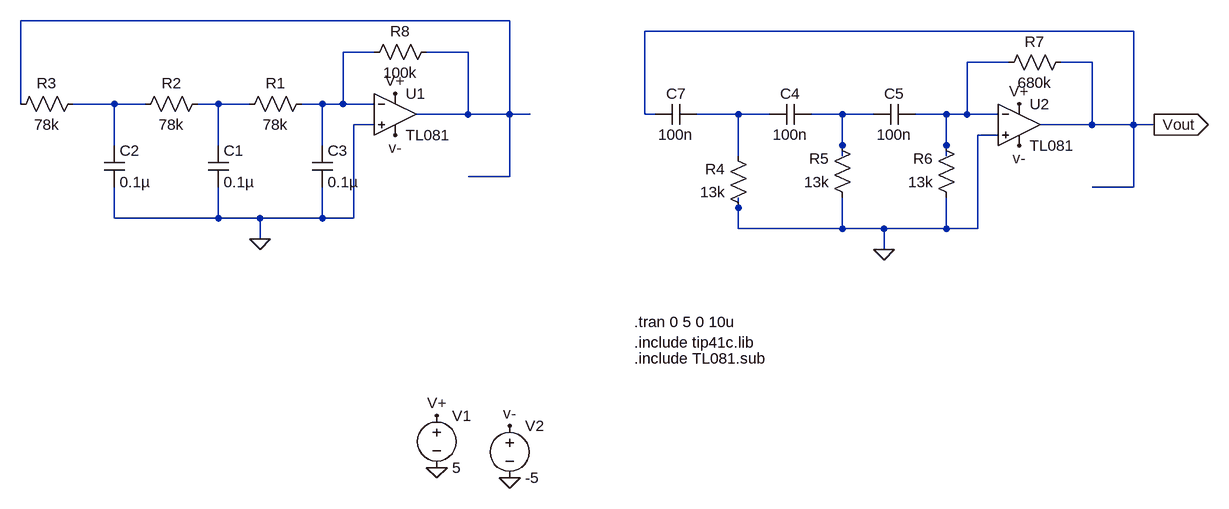
[diagram p0: schematic vib4_phase_shift.asc]
vib4_phase_shift.asc, the LTspice schematic file:
Version 4
SHEET 1 1456 680
WIRE 352 -96 -400 -96
WIRE 1312 -80 560 -80
WIRE 144 -48 96 -48
WIRE 288 -48 224 -48
WIRE 1120 -32 1056 -32
WIRE 1248 -32 1200 -32
WIRE -400 32 -400 -96
WIRE -256 32 -320 32
WIRE -208 32 -256 32
WIRE -96 32 -128 32
WIRE -48 32 -96 32
WIRE 64 32 32 32
WIRE 96 32 96 -48
WIRE 96 32 64 32
WIRE 144 32 96 32
WIRE 288 48 288 -48
WIRE 288 48 208 48
WIRE 352 48 352 -96
WIRE 352 48 288 48
WIRE 384 48 352 48
WIRE 560 48 560 -80
WIRE 576 48 560 48
WIRE 704 48 640 48
WIRE 752 48 704 48
WIRE 864 48 816 48
WIRE 912 48 864 48
WIRE 1024 48 976 48
WIRE 1056 48 1056 -32
WIRE 1056 48 1024 48
WIRE 1104 48 1056 48
WIRE 144 64 112 64
WIRE 1248 64 1248 -32
WIRE 1248 64 1168 64
WIRE 1312 64 1312 -80
WIRE 1312 64 1248 64
WIRE 1344 64 1312 64
WIRE 1104 80 1072 80
WIRE -256 96 -256 32
WIRE -96 96 -96 32
WIRE 64 96 64 32
WIRE 864 96 864 48
WIRE 1024 96 1024 48
WIRE 704 112 704 48
WIRE 864 112 864 96
WIRE 1024 112 1024 96
WIRE 352 144 352 48
WIRE 352 144 288 144
WIRE 1312 160 1312 64
WIRE 1312 160 1248 160
WIRE 704 192 704 176
WIRE -256 208 -256 160
WIRE -96 208 -96 160
WIRE -96 208 -256 208
WIRE -32 208 -96 208
WIRE 64 208 64 160
WIRE 64 208 -32 208
WIRE 112 208 112 64
WIRE 112 208 64 208
WIRE 704 224 704 192
WIRE 864 224 864 176
WIRE 864 224 704 224
WIRE 928 224 864 224
WIRE 1024 224 1024 176
WIRE 1024 224 928 224
WIRE 1072 224 1072 80
WIRE 1072 224 1024 224
WIRE -32 240 -32 208
WIRE 928 256 928 224
FLAG 176 16 V+
FLAG 240 592 0
FLAG 352 528 v-
FLAG 176 80 v-
FLAG 352 608 0
FLAG -32 240 0
FLAG 1344 64 Vout
IOPIN 1344 64 Out
FLAG 1136 32 V+
FLAG 1136 96 v-
FLAG 928 256 0
FLAG 240 512 V+
SYMBOL OpAmps\\opamp2 176 -16 R0
SYMATTR InstName U1
SYMATTR Value TL081
SYMBOL voltage 240 496 R0
WINDOW 123 0 0 Left 0
WINDOW 39 0 0 Left 0
SYMATTR InstName V1
SYMATTR Value 5
SYMBOL voltage 352 512 R0
WINDOW 123 0 0 Left 0
WINDOW 39 0 0 Left 0
SYMATTR InstName V2
SYMATTR Value -5
SYMBOL res 48 16 R90
WINDOW 0 0 56 VBottom 2
WINDOW 3 32 56 VTop 2
SYMATTR InstName R1
SYMATTR Value 78k
SYMBOL res -112 16 R90
WINDOW 0 0 56 VBottom 2
WINDOW 3 32 56 VTop 2
SYMATTR InstName R2
SYMATTR Value 78k
SYMBOL res -304 16 R90
WINDOW 0 0 56 VBottom 2
WINDOW 3 32 56 VTop 2
SYMATTR InstName R3
SYMATTR Value 78k
SYMBOL cap -112 96 R0
SYMATTR InstName C1
SYMATTR Value 0.1µ
SYMBOL cap -272 96 R0
SYMATTR InstName C2
SYMATTR Value 0.1µ
SYMBOL cap 48 96 R0
SYMATTR InstName C3
SYMATTR Value 0.1µ
SYMBOL OpAmps\\opamp2 1136 0 R0
SYMATTR InstName U2
SYMATTR Value TL081
SYMBOL cap 640 32 R90
WINDOW 0 0 32 VBottom 2
WINDOW 3 32 32 VTop 2
SYMATTR InstName C7
SYMATTR Value 100n
SYMBOL cap 816 32 R90
WINDOW 0 0 32 VBottom 2
WINDOW 3 32 32 VTop 2
SYMATTR InstName C4
SYMATTR Value 100n
SYMBOL cap 976 32 R90
WINDOW 0 0 32 VBottom 2
WINDOW 3 32 32 VTop 2
SYMATTR InstName C5
SYMATTR Value 100n
SYMBOL res 720 208 R180
WINDOW 0 36 76 Left 2
WINDOW 3 36 40 Left 2
SYMATTR InstName R4
SYMATTR Value 13k
SYMBOL res 880 192 R180
WINDOW 0 36 76 Left 2
WINDOW 3 36 40 Left 2
SYMATTR InstName R5
SYMATTR Value 13k
SYMBOL res 1040 192 R180
WINDOW 0 36 76 Left 2
WINDOW 3 36 40 Left 2
SYMATTR InstName R6
SYMATTR Value 13k
SYMBOL res 1216 -48 R90
WINDOW 0 0 56 VBottom 2
WINDOW 3 32 56 VTop 2
SYMATTR InstName R7
SYMATTR Value 680k
SYMBOL res 240 -64 R90
WINDOW 0 0 56 VBottom 2
WINDOW 3 32 56 VTop 2
SYMATTR InstName R8
SYMATTR Value 100k
TEXT 544 368 Left 2 !.tran 0 5 0 10u\n.include tip41c.lib
TEXT 544 424 Left 2 !.include TL081.sub

The netlist it stands for:
* vib4_phase_shift.asc
XU1 0 N002 V+ v- N001 TL081  ; pins In+ In- V+ V- OUT
V1 V+ 0 5
V2 v- 0 -5
R1 N002 N005 78k
R2 N005 N004 78k
R3 N004 N001 78k
C1 N005 0 0.1µ
C2 N004 0 0.1µ
C3 N002 0 0.1µ
XU2 0 N003 V+ v- Vout TL081  ; pins In+ In- V+ V- OUT
C7 N006 Vout 100n
C4 N007 N006 100n
C5 N003 N007 100n
R4 0 N006 13k
R5 0 N007 13k
R6 0 N003 13k
R7 Vout N003 680k
R8 N001 N002 100k
.tran 0 5 0 10u
.include tip41c.lib
.include TL081.sub
.backanno
.end